# EAGLE schematic VDC (EAGLE 6.4)
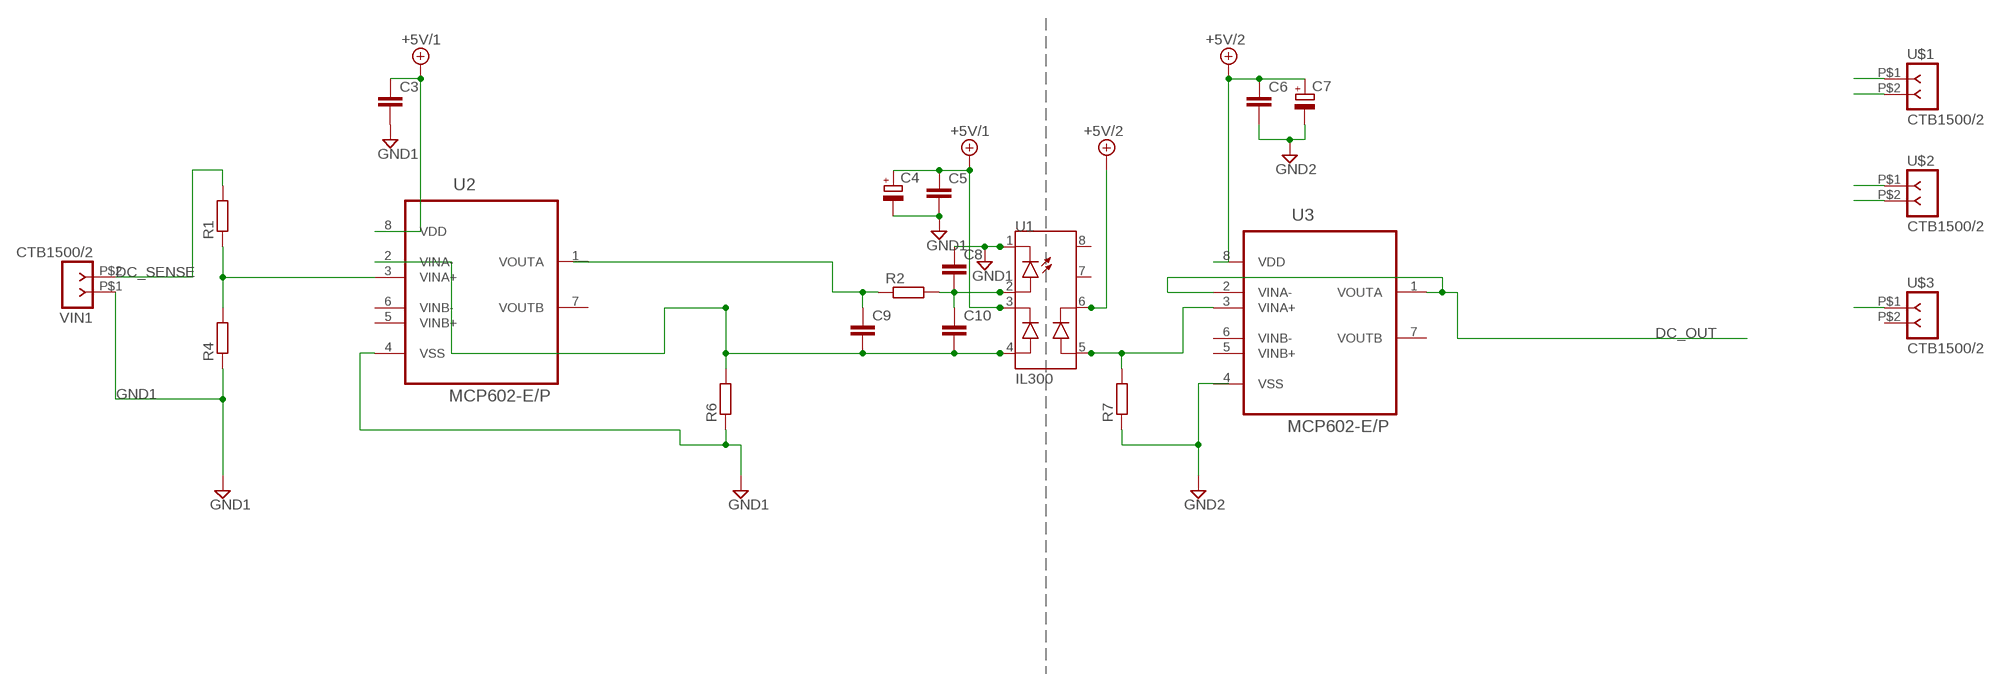
[diagram p0: schematic, sheet 1]

## Parts
C3  C-EU025-040X050  [C025-040X050]
C4  CPOL-EUE2-5  [E2-5]
C5  C-EU025-040X050  [C025-040X050]
C6  C-EU025-040X050  [C025-040X050]
C7  CPOL-EUE2-5  [E2-5]
C8  C-EU025-040X050  [C025-040X050]
C9  C-EU025-040X050  [C025-040X050]
C10  C-EU025-040X050  [C025-040X050]
R1  R-EU_0207/10  [0207/10]
R2  R-EU_0207/10  [0207/10]
R4  R-EU_0207/10  [0207/10]
R6  R-EU_0207/10  [0207/10]
R7  R-EU_0207/10  [0207/10]
U1  IL300  [DIL08]
U2  MCP602-E/P  [DIP254P762X508-8P]
U3  MCP602-E/P  [DIP254P762X508-8P]
U$1  CTB1500/2  [CTB1500-2]
U$2  CTB1500/2  [CTB1500-2]
U$3  CTB1500/2  [CTB1500-2]
VIN1  CTB1500/2  [CTB1500-2]

## Nets
+5V/1: C3.1 C4.+ C5.1 U1.3(C_FB) U2.8(VDD) U$1.P$2
+5V/2: C6.1 C7.+ U1.6(C_OUT) U3.8(VDD) U$2.P$2
DC_OUT: U3.1(VOUTA) U3.2(VINA-) U$3.P$1
DC_SENSE: R1.2 VIN1.P$2
GND1: C3.2 C4.- C5.2 C8.1 R4.1 R6.1 U1.1(C_LED) U2.4(VSS) U$1.P$1 VIN1.P$1
GND2: C6.2 C7.- R7.1 U$2.P$1
N$1: C9.2 C10.2 R6.2 U1.4(A_FB) U2.2(VINA-)
N$3: R7.2 U1.5(A_OUT) U3.3(VINA+)
N$4: C8.2 C10.1 R2.2 U1.2(A_LED)
N$5: C9.1 R2.1
N$8: R1.1 R4.2 U2.3(VINA+)
Unconnected: U1.7(PIN7) U1.8(PIN8) U2.1(VOUTA) U2.5(VINB+) U2.6(VINB-) U2.7(VOUTB) U3.5(VINB+) U3.6(VINB-) U3.7(VOUTB) U$3.P$2

## Power pins joined to a net without a drawn wire
VSS: U3.4(VSS)

## Library data of the parts
C3 C5 C6 C8-C10 = resistor:C-EU: CAPACITOR, European symbol
C4 C7 = resistor:CPOL-EU: POLARIZED CAPACITOR, European symbol
R1 R2 R4 R6 R7 = resistor:R-EU_: RESISTOR, European symbol
U1 = ic-optoisolator:IL300
U2 U3 = MCP:MCP602-E/P: IC, 2.7V to 5.5V Single-Supply CMOS Dual Op Amps,DIP-8; MPN: MCP602-E/P; OC_FARNELL: 1852042; OC_NEWARK: 88H9870; PACKAGE: DIP-8; SUPPLIER: Microchip
U$1-U$3 VIN1 = eko-parts:CTB1500/2